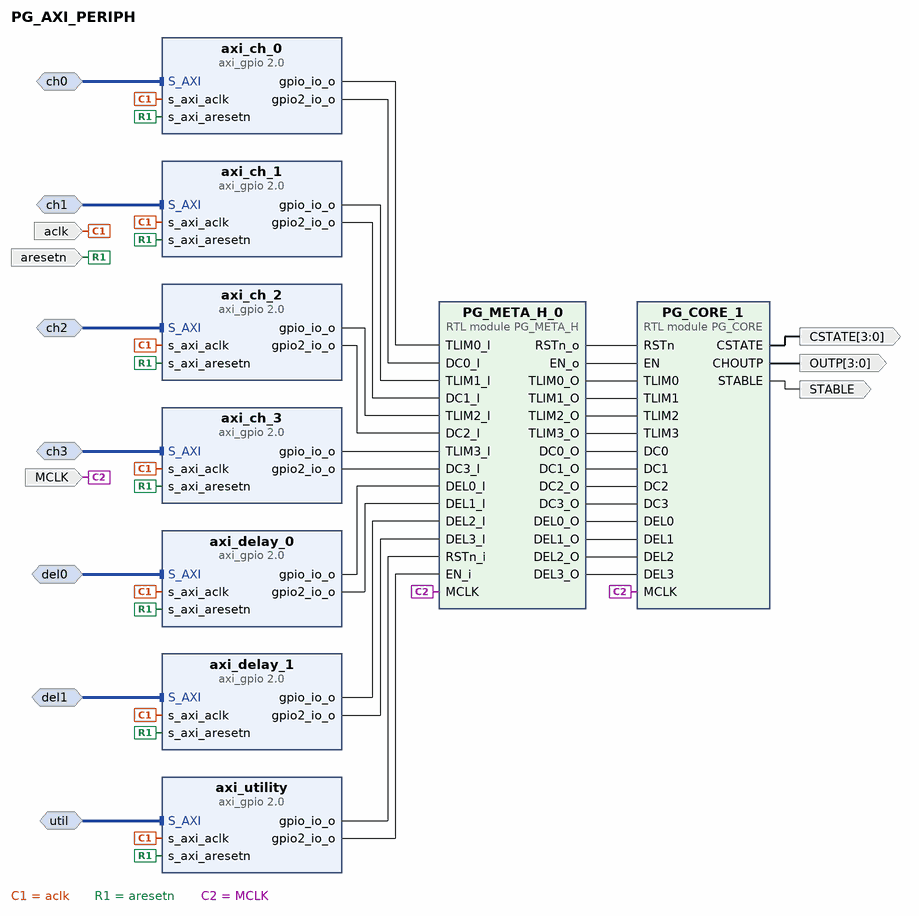
[diagram p0: block diagram of the top level]
# Vivado block design PG_AXI_PERIPH, xc7z020clg400-1, Vivado 2019.1
create_bd_design PG_AXI_PERIPH

create_bd_intf_port -mode Slave -vlnv xilinx.com:interface:aximm_tlm:1.0 ch0
create_bd_intf_port -mode Slave -vlnv xilinx.com:interface:aximm_tlm:1.0 ch1
create_bd_intf_port -mode Slave -vlnv xilinx.com:interface:aximm_tlm:1.0 ch2
create_bd_intf_port -mode Slave -vlnv xilinx.com:interface:aximm_tlm:1.0 ch3
create_bd_intf_port -mode Slave -vlnv xilinx.com:interface:aximm_tlm:1.0 del0
create_bd_intf_port -mode Slave -vlnv xilinx.com:interface:aximm_tlm:1.0 del1
create_bd_intf_port -mode Slave -vlnv xilinx.com:interface:aximm_tlm:1.0 util
create_bd_port -dir I aclk
create_bd_port -dir I aresetn
create_bd_port -dir O -from 3 -to 0 OUTP
create_bd_port -dir O STABLE
create_bd_port -dir O -from 3 -to 0 CSTATE
create_bd_port -dir I MCLK

create_bd_cell -type ip -vlnv xilinx.com:ip:axi_gpio:2.0 axi_ch_0
set_property -dict {CONFIG.C_ALL_OUTPUTS 1 CONFIG.C_ALL_OUTPUTS_2 1 CONFIG.C_IS_DUAL 1} [get_bd_cells axi_ch_0]
create_bd_cell -type ip -vlnv xilinx.com:ip:axi_gpio:2.0 axi_ch_1
set_property -dict {CONFIG.C_ALL_OUTPUTS 1 CONFIG.C_ALL_OUTPUTS_2 1 CONFIG.C_IS_DUAL 1} [get_bd_cells axi_ch_1]
create_bd_cell -type ip -vlnv xilinx.com:ip:axi_gpio:2.0 axi_ch_2
set_property -dict {CONFIG.C_ALL_OUTPUTS 1 CONFIG.C_ALL_OUTPUTS_2 1 CONFIG.C_IS_DUAL 1} [get_bd_cells axi_ch_2]
create_bd_cell -type ip -vlnv xilinx.com:ip:axi_gpio:2.0 axi_ch_3
set_property -dict {CONFIG.C_ALL_OUTPUTS 1 CONFIG.C_ALL_OUTPUTS_2 1 CONFIG.C_IS_DUAL 1} [get_bd_cells axi_ch_3]
create_bd_cell -type ip -vlnv xilinx.com:ip:axi_gpio:2.0 axi_delay_0
set_property -dict {CONFIG.C_ALL_OUTPUTS 1 CONFIG.C_ALL_OUTPUTS_2 1 CONFIG.C_IS_DUAL 1} [get_bd_cells axi_delay_0]
create_bd_cell -type ip -vlnv xilinx.com:ip:axi_gpio:2.0 axi_delay_1
set_property -dict {CONFIG.C_ALL_OUTPUTS 1 CONFIG.C_ALL_OUTPUTS_2 1 CONFIG.C_IS_DUAL 1} [get_bd_cells axi_delay_1]
create_bd_cell -type ip -vlnv xilinx.com:ip:axi_gpio:2.0 axi_utility
set_property -dict [list \
  CONFIG.C_ALL_OUTPUTS 1 \
  CONFIG.C_ALL_OUTPUTS_2 1 \
  CONFIG.C_GPIO2_WIDTH 4 \
  CONFIG.C_GPIO_WIDTH 1 \
  CONFIG.C_IS_DUAL 1 \
] [get_bd_cells axi_utility]
create_bd_cell -type module -reference PG_META_H PG_META_H_0
create_bd_cell -type module -reference PG_CORE PG_CORE_1

# ---- connections ----

connect_bd_intf_net -intf_net ch0_1 [get_bd_intf_ports ch0] [get_bd_intf_pins axi_ch_0/S_AXI]
connect_bd_intf_net -intf_net ch2_1 [get_bd_intf_ports ch2] [get_bd_intf_pins axi_ch_2/S_AXI]
connect_bd_intf_net -intf_net ch1_1 [get_bd_intf_ports ch1] [get_bd_intf_pins axi_ch_1/S_AXI]
connect_bd_intf_net -intf_net del1_1 [get_bd_intf_ports del1] [get_bd_intf_pins axi_delay_1/S_AXI]
connect_bd_intf_net -intf_net del0_1 [get_bd_intf_ports del0] [get_bd_intf_pins axi_delay_0/S_AXI]
connect_bd_intf_net -intf_net ch3_1 [get_bd_intf_ports ch3] [get_bd_intf_pins axi_ch_3/S_AXI]
connect_bd_intf_net [get_bd_intf_ports util] [get_bd_intf_pins axi_utility/S_AXI]
connect_bd_net [get_bd_ports aclk] \
  [get_bd_pins axi_ch_0/s_axi_aclk] [get_bd_pins axi_ch_1/s_axi_aclk] [get_bd_pins axi_ch_2/s_axi_aclk] \
  [get_bd_pins axi_ch_3/s_axi_aclk] [get_bd_pins axi_delay_0/s_axi_aclk] [get_bd_pins axi_delay_1/s_axi_aclk] \
  [get_bd_pins axi_utility/s_axi_aclk]
connect_bd_net [get_bd_ports aresetn] \
  [get_bd_pins axi_utility/s_axi_aresetn] [get_bd_pins axi_delay_1/s_axi_aresetn] [get_bd_pins axi_delay_0/s_axi_aresetn] \
  [get_bd_pins axi_ch_3/s_axi_aresetn] [get_bd_pins axi_ch_2/s_axi_aresetn] [get_bd_pins axi_ch_1/s_axi_aresetn] \
  [get_bd_pins axi_ch_0/s_axi_aresetn]
connect_bd_net [get_bd_ports MCLK] [get_bd_pins PG_META_H_0/MCLK] [get_bd_pins PG_CORE_1/MCLK]
connect_bd_net [get_bd_pins PG_CORE_1/CHOUTP] [get_bd_ports OUTP]
connect_bd_net [get_bd_pins PG_CORE_1/STABLE] [get_bd_ports STABLE]
connect_bd_net [get_bd_pins PG_CORE_1/CSTATE] [get_bd_ports CSTATE]
connect_bd_net [get_bd_pins axi_ch_0/gpio_io_o] [get_bd_pins PG_META_H_0/TLIM0_I]
connect_bd_net [get_bd_pins axi_ch_0/gpio2_io_o] [get_bd_pins PG_META_H_0/DC0_I]
connect_bd_net [get_bd_pins axi_ch_1/gpio_io_o] [get_bd_pins PG_META_H_0/TLIM1_I]
connect_bd_net [get_bd_pins axi_ch_1/gpio2_io_o] [get_bd_pins PG_META_H_0/DC1_I]
connect_bd_net [get_bd_pins axi_ch_2/gpio_io_o] [get_bd_pins PG_META_H_0/TLIM2_I]
connect_bd_net [get_bd_pins axi_ch_2/gpio2_io_o] [get_bd_pins PG_META_H_0/DC2_I]
connect_bd_net [get_bd_pins axi_ch_3/gpio_io_o] [get_bd_pins PG_META_H_0/TLIM3_I]
connect_bd_net [get_bd_pins axi_ch_3/gpio2_io_o] [get_bd_pins PG_META_H_0/DC3_I]
connect_bd_net [get_bd_pins axi_delay_0/gpio_io_o] [get_bd_pins PG_META_H_0/DEL0_I]
connect_bd_net [get_bd_pins axi_delay_0/gpio2_io_o] [get_bd_pins PG_META_H_0/DEL1_I]
connect_bd_net [get_bd_pins axi_delay_1/gpio_io_o] [get_bd_pins PG_META_H_0/DEL2_I]
connect_bd_net [get_bd_pins axi_delay_1/gpio2_io_o] [get_bd_pins PG_META_H_0/DEL3_I]
connect_bd_net [get_bd_pins axi_utility/gpio_io_o] [get_bd_pins PG_META_H_0/RSTn_i]
connect_bd_net [get_bd_pins axi_utility/gpio2_io_o] [get_bd_pins PG_META_H_0/EN_i]
connect_bd_net [get_bd_pins PG_META_H_0/RSTn_o] [get_bd_pins PG_CORE_1/RSTn]
connect_bd_net [get_bd_pins PG_META_H_0/EN_o] [get_bd_pins PG_CORE_1/EN]
connect_bd_net [get_bd_pins PG_META_H_0/TLIM0_O] [get_bd_pins PG_CORE_1/TLIM0]
connect_bd_net [get_bd_pins PG_META_H_0/TLIM1_O] [get_bd_pins PG_CORE_1/TLIM1]
connect_bd_net [get_bd_pins PG_META_H_0/TLIM2_O] [get_bd_pins PG_CORE_1/TLIM2]
connect_bd_net [get_bd_pins PG_META_H_0/TLIM3_O] [get_bd_pins PG_CORE_1/TLIM3]
connect_bd_net [get_bd_pins PG_META_H_0/DC0_O] [get_bd_pins PG_CORE_1/DC0]
connect_bd_net [get_bd_pins PG_META_H_0/DC1_O] [get_bd_pins PG_CORE_1/DC1]
connect_bd_net [get_bd_pins PG_META_H_0/DC2_O] [get_bd_pins PG_CORE_1/DC2]
connect_bd_net [get_bd_pins PG_META_H_0/DC3_O] [get_bd_pins PG_CORE_1/DC3]
connect_bd_net [get_bd_pins PG_META_H_0/DEL0_O] [get_bd_pins PG_CORE_1/DEL0]
connect_bd_net [get_bd_pins PG_META_H_0/DEL1_O] [get_bd_pins PG_CORE_1/DEL1]
connect_bd_net [get_bd_pins PG_META_H_0/DEL2_O] [get_bd_pins PG_CORE_1/DEL2]
connect_bd_net [get_bd_pins PG_META_H_0/DEL3_O] [get_bd_pins PG_CORE_1/DEL3]

validate_bd_design
save_bd_design
